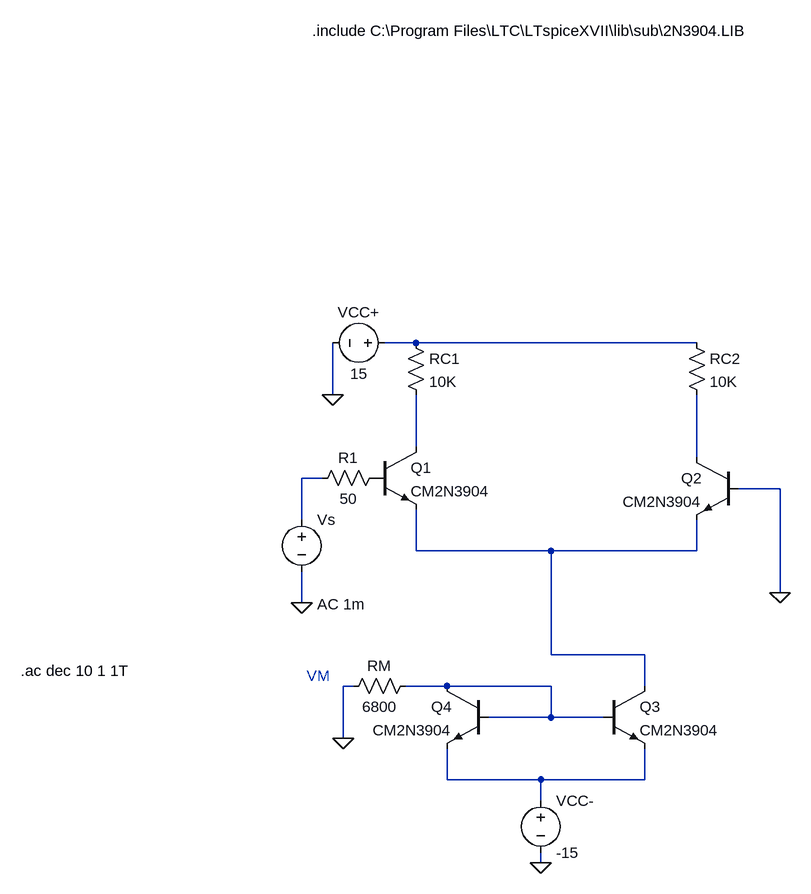
[diagram p0: schematic Part 3 differential amp.asc]
Part 3 differential amp.asc, the LTspice schematic file:
Version 4
SHEET 1 1088 1156
WIRE -96 272 -144 272
WIRE 336 272 -96 272
WIRE -224 352 -224 272
WIRE -96 432 -96 352
WIRE 336 448 336 352
WIRE -240 480 -272 480
WIRE 464 496 400 496
WIRE -272 544 -272 480
WIRE -96 592 -96 528
WIRE 112 592 -96 592
WIRE 336 592 336 544
WIRE 336 592 112 592
WIRE 464 656 464 496
WIRE -272 672 -272 624
WIRE 112 752 112 592
WIRE 256 752 112 752
WIRE -192 800 -208 800
WIRE -48 800 -112 800
WIRE 112 800 -48 800
WIRE 256 800 256 752
WIRE 112 848 112 800
WIRE 112 848 16 848
WIRE 192 848 112 848
WIRE -208 880 -208 800
WIRE -48 944 -48 896
WIRE 96 944 -48 944
WIRE 256 944 256 896
WIRE 256 944 96 944
WIRE 96 976 96 944
WIRE 96 1072 96 1056
FLAG -272 672 0
FLAG -208 880 0
FLAG 96 1072 0
FLAG -224 352 0
FLAG 464 656 0
SYMBOL voltage -128 272 R90
WINDOW 0 -32 56 VBottom 2
WINDOW 3 32 56 VTop 2
SYMATTR InstName VCC+
SYMATTR Value 15
SYMBOL res -112 256 R0
SYMATTR InstName RC1
SYMATTR Value 10K
SYMBOL res 320 256 R0
SYMATTR InstName RC2
SYMATTR Value 10K
SYMBOL npn -160 432 R0
SYMATTR InstName Q1
SYMATTR Value CM2N3904
SYMBOL npn 400 448 M0
SYMATTR InstName Q2
SYMATTR Value CM2N3904
SYMBOL voltage -272 528 R0
WINDOW 123 24 146 Left 2
WINDOW 39 0 0 Left 0
SYMATTR Value2 AC 1m
SYMATTR InstName Vs
SYMATTR Value ""
SYMBOL npn 192 800 R0
SYMATTR InstName Q3
SYMATTR Value CM2N3904
SYMBOL npn 16 800 M0
SYMATTR InstName Q4
SYMATTR Value CM2N3904
SYMBOL res -96 784 R90
WINDOW 0 0 56 VBottom 2
WINDOW 3 32 56 VTop 2
SYMATTR InstName RM
SYMATTR Value 6800
SYMBOL voltage 96 960 R0
SYMATTR InstName VCC-
SYMATTR Value -15
SYMBOL res -144 464 R90
WINDOW 0 0 56 VBottom 2
WINDOW 3 32 56 VTop 2
SYMATTR InstName R1
SYMATTR Value 50
TEXT -256 -208 Left 2 !.include C:\\Program Files\\LTC\\LTspiceXVII\\lib\\sub\\2N3904.LIB
TEXT -264 784 Left 2 ;VM
TEXT -704 776 Left 2 !.ac dec 10 1 1T

The netlist it stands for:
* Part 3 differential amp.asc
VCC+ N001 0 15
RC1 N001 N002 10K
RC2 N001 N003 10K
Q1 N002 P001 N005 0 CM2N3904
Q2 N003 0 N005 0 CM2N3904
Vs N004 0 AC 1m
Q3 N005 N006 N007 0 CM2N3904
Q4 N006 N006 N007 0 CM2N3904
RM N006 0 6800
VCC- N007 0 -15
R1 P001 N004 50
.model NPN NPN
.model PNP PNP
.lib standard.bjt
.include C:\Program Files\LTC\LTspiceXVII\lib\sub\2N3904.LIB
* VM
.ac dec 10 1 1T
.backanno
.end